# Altium schematic sheet DoorLocker.SchDoc
size A4
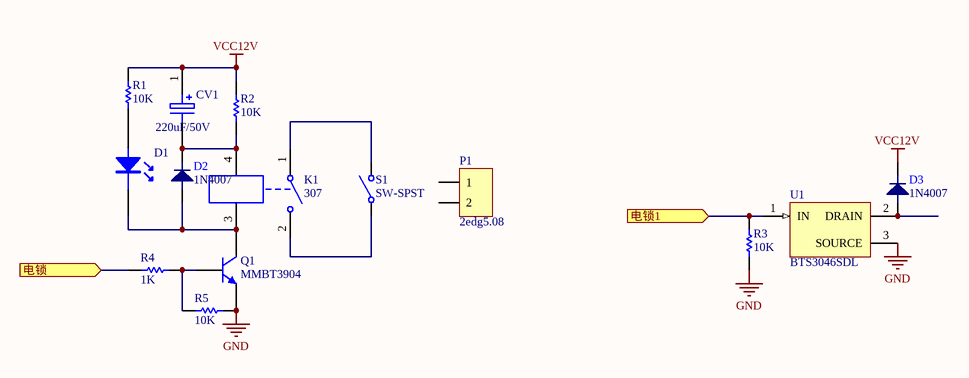
[diagram p0: DoorLocker.SchDoc]

## Parts
CV1  220uF/50V  [CAPPR5-10x20/H1.1]
D1  (no value)  [0805-L]
D2  1N4007  [DO-214AC(SMA)]
D3  1N4007  [DO-214AC(SMA)]
K1  307  [RELAY-SONGCHUAN]
P1  2edg5.08  [2edg5.08_2]
Q1  MMBT3904  [SOT23_N]
R1  value 10K  [RESC0805(2012)_M]  (hidden comment: 10K 1% 0805(2012))
R2  value 10K  [RESC0805(2012)_M]  (hidden comment: 10K 1% 0805(2012))
R3  value 10K  [RESC0805(2012)_M]  (hidden comment: 10K 1% 0805(2012))
R4  value 1K  [RESC0805(2012)_M]  (hidden comment: 1K 1% 0805(2012))
R5  value 10K  [RESC0805(2012)_M]  (hidden comment: 10K 1% 0805(2012))
S1  SW-SPST  [SPST-2]
U1  BTS3046SDL  [INF-PG-TO252-3-11_M]

## Ports
电锁1 (in), 电锁 (in)

## Nets
GND: Q1.2(E) R3.2 R5.1 U1.3(SOURCE)
VCC12V: CV1.1 D3.2 R1.1 R2.1
电锁: R4.2 ; port 电锁
电锁1: R3.1 U1.1(IN) ; port 电锁1
NetCV1_2: CV1.2 D2.2 K1.4 R2.2
NetD1_1: D1.1 R1.2
NetD1_2: D1.2 D2.1 K1.3 Q1.3(C)
NetD3_1: D3.1 U1.2(DRAIN)
NetK1_1: K1.1 S1.2(NO)
NetK1_2: K1.2 S1.1(COMMON)
NetQ1_1: Q1.1(B) R4.1 R5.2

Not connected (* = marked no-connect by the designer): P1 1 2

## Library data of the parts
CV1 = ELECTRO1: aluminum electrolytic capacitor; Manufacturer: Yageo; Value: 220uF; Model: SL050K0220A5S-1019; Parameter: 220uF/50V
D1 = LED
D2 D3 = 1N4007: 1A整流二极管
K1 = JDQ_307: 继电器
P1 = 2EDG5.08_2: 端子
Q1 = MMBT3904: NPN Switching Transistor; Published: 17-Sep-2003; LatestRevisionDate: 12-Dec-2006; LatestRevisionNote: IPC-7351 Footprint Added.; DatasheetVersion: 13-May-2002; PackageVersion: May-1999; PackageReference: SOT23; Publisher: Altium Limited; PackageDescription: 3-Pin SOT-23 Package 0.95 mm Pitch, 2.3 mm Lead Span; ComponentLink1Description: Manufacturer Link; ComponentLink1URL: http://www.semiconductors.philips.com/; ComponentLink2Description: Datasheet; ComponentLink2URL: http://www.semiconductors.philips.com/acrobat/datasheets/MMBT3904_4.pdf
R1-R3 R5 = CMP-1013-00623-1: 10K 0.125W 1% 0805 (2012 Metric)  SMD; Case-Metric: 2012; Case-EIA: 0805; Tolerance: 1 %; Power: 0.125 W; Technology: SMT
R4 = CMP-1013-00510-1: 1K 0.125W 1% 0805 (2012 Metric)  SMD; Case-Metric: 2012; Case-EIA: 0805; Tolerance: 1 %; Power: 0.125 W; Technology: SMT
S1 = SW-SPST: Single-Pole, Single-Throw Switch; Published: 24-Mar-1999; LatestRevisionDate: 17-Jul-2002; LatestRevisionNote: Re-released for DXP Platform.; PackageReference: SPST-2; Publisher: Altium Limited
U1 = CMP-1137-00025-1: HITFET 46 mOhm Single Channel Smart Low Side Power Switch for12 V & 24 V Application, 60 V VDS, 3.6 A ID, -40 to 150 degC, PG-TO252-3-11, Reel, Green; Manufacturer: Infineon; toff (max): 120 us; ton (max): 100 us; ID(lim) (min): 10 A; Channels: 1; RDS (on)(max): 50 mOhm; Green: TRUE; ID(nom): 3.6 A; VDS (max): 60 V; PackageDescription: 3-Pin Plastic (Green) Transistor Single Outline Package, 6.5 x 6.12 mm Body, 2.28 mm Pitch; PackageVersion: Dec-06; ComponentLink2URL: http://www.infineon.com/dgdl/BTS3046SDL_DS_10.pdf?folderId=db3a3043163797a6011667aa084c0e01&fileId=db3a304325afd6e001263232a5146438&location=en.Products.Automotive_ICs.Smart_High-_and_Low-Side_Switches.HITFET___TEMPFET__-_Smart_Low-Side_Switches.DATASHEET.; Halogen-free: TRUE; ComponentLink3Description: Package Specification; DatasheetVersion: Rev. 1.0; ComponentLink1Description: Manufacturer URL; PackageReference: PG-TO252-3-11; ComponentLink1URL: http://www.infineon.com/; PartNumber: BTS3046SDL; Packing: Reel; ID: 3.6 A; Mounting Technology: Surface Mount; Group: HITFET; ComponentLink2Description: Datasheet; ComponentLink3URL: http://www.infineon.com/dgdl/BTS142_DS_13.pdf?folderId=db3a3043163797a6011667aa084c0e01&fileId=db3a3043163797a6011667ac98be0e02&location=en.Products.Automotive_ICs.Smart_High-_and_Low-Side_Switches.HITFET___TEMPFET__-_Smart_Low-Side_Switches.DATASHEET.BTS1